# EAGLE schematic ArduinoOnBoard (EAGLE 8.4.1)
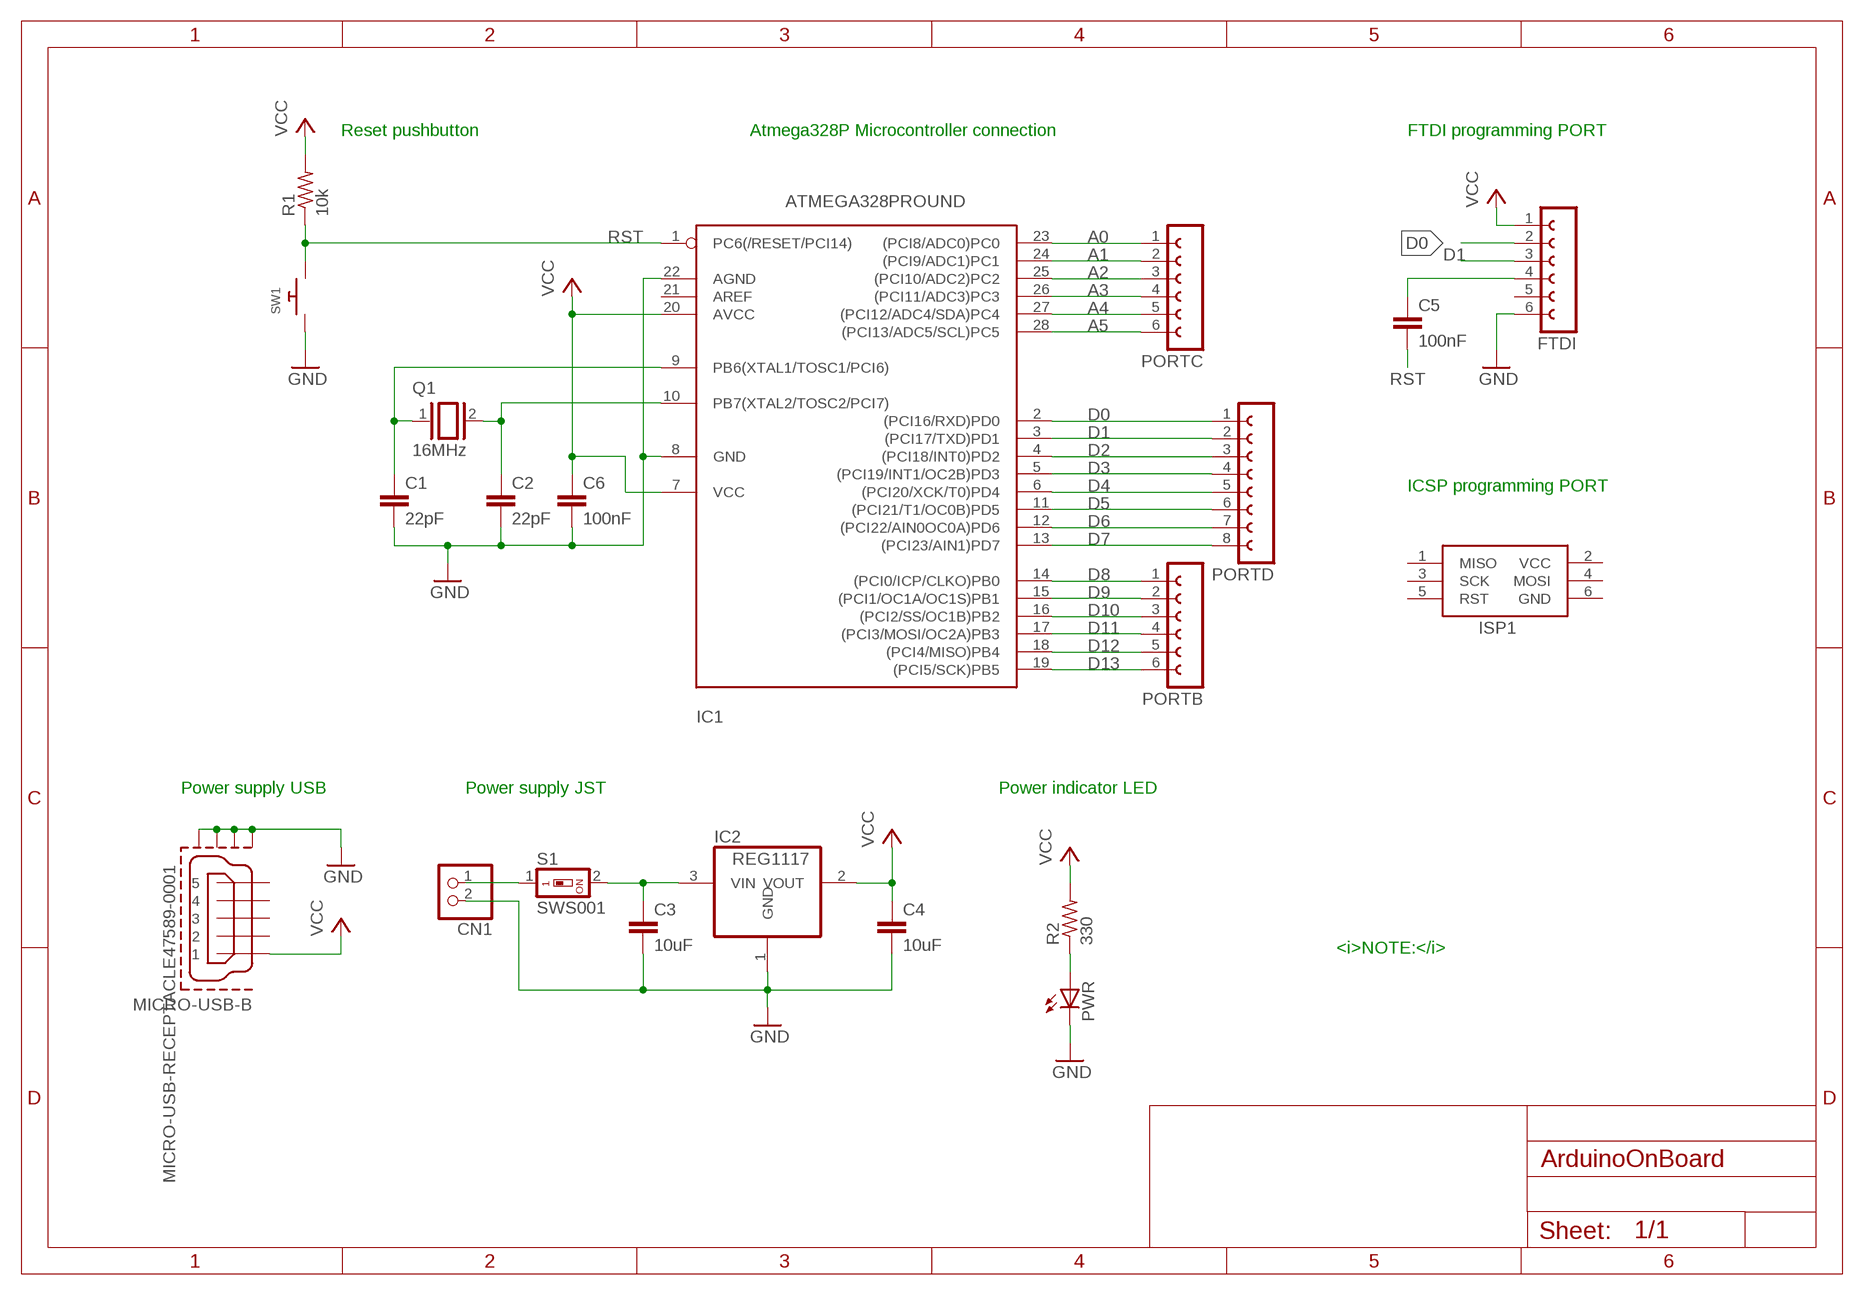
[diagram p0: schematic, sheet 1]

## Parts
C1  22pF  C-EUC1310  [C1310]
C2  22pF  C-EUC1310  [C1310]
C3  10uF  C-EUC1310  [C1310]
C4  10uF  C-EUC1310  [C1310]
C5  100nF  C-EUC1310  [C1310]
C6  100nF  C-EUC1310  [C1310]
CN1  JST_2PIN-SMT  [JST-PH-2-SMT]
FTDI  FE06-1  [FE06]
IC1  ATMEGA328PROUND  [DIL28-3-ROUND]
IC2  REG1117  [SOT223]
ISP1  AVRISP-6  [AVRISP]
MICRO-USB-B  MICRO-USB-RECEPTACLE47589-0001  [47589-0001]
PORTB  FE06-1  [FE06]
PORTC  FE06-1  [FE06]
PORTD  FE08-1  [FE08]
PWR  LEDCHIPLED_0805  [CHIPLED_0805]
Q1  16MHz  XTAL/S  [QS]
R1  10k  R-US_M1206  [M1206]
R2  330  R-US_M1206  [M1206]
S1  SWS001  [SMS-001]
SW1  SWITCH_PUSHBUTTONEVQ-PE  [TACT_PANA-EVQ]

## Nets
A0: IC1.23((PCI8/ADC0)PC0) PORTC.1
A1: IC1.24((PCI9/ADC1)PC1) PORTC.2
A2: IC1.25((PCI10/ADC2)PC2) PORTC.3
A3: IC1.26((PCI11/ADC3)PC3) PORTC.4
A4: IC1.27((PCI12/ADC4/SDA)PC4) PORTC.5
A5: IC1.28((PCI13/ADC5/SCL)PC5) PORTC.6
D0: FTDI.2 IC1.2((PCI16/RXD)PD0) PORTD.1
D1: FTDI.3 IC1.3((PCI17/TXD)PD1) PORTD.2
D2: IC1.4((PCI18/INT0)PD2) PORTD.3
D3: IC1.5((PCI19/INT1/OC2B)PD3) PORTD.4
D4: IC1.6((PCI20/XCK/T0)PD4) PORTD.5
D5: IC1.11((PCI21/T1/OC0B)PD5) PORTD.6
D6: IC1.12((PCI22/AIN0OC0A)PD6) PORTD.7
D7: IC1.13((PCI23/AIN1)PD7) PORTD.8
D8: IC1.14((PCI0/ICP/CLKO)PB0) PORTB.1
D9: IC1.15((PCI1/OC1A/OC1S)PB1) PORTB.2
D10: IC1.16((PCI2/SS/OC1B)PB2) PORTB.3
D11: IC1.17((PCI3/MOSI/OC2A)PB3) PORTB.4
D12: IC1.18((PCI4/MISO)PB4) PORTB.5
D13: IC1.19((PCI5/SCK)PB5) PORTB.6
GND: C1.2 C2.2 C3.2 C4.2 C6.2 CN1.2 FTDI.6 IC1.8(GND) IC1.22(AGND) IC2.1(GND) MICRO-USB-B.CASING1(GND1) MICRO-USB-B.CASING2(GND2) MICRO-USB-B.CASING3(GND3) MICRO-USB-B.CASING4(GND4) PWR.C SW1.P$1
N$1: C5.1 FTDI.4
N$2: C1.1 IC1.9(PB6(XTAL1/TOSC1/PCI6)) Q1.1
N$3: C2.1 IC1.10(PB7(XTAL2/TOSC2/PCI7)) Q1.2
N$4: C3.1 IC2.3(VIN) S1.2
N$5: PWR.A R2.1
N$6: CN1.1 S1.1
RST: C5.2 IC1.1(PC6(/RESET/PCI14)) R1.1 SW1.P$2
VCC: C4.1 C6.1 FTDI.1 IC1.7(VCC) IC1.20(AVCC) IC2.2(VOUT) MICRO-USB-B.1 R1.2 R2.2
Unconnected: FTDI.5 IC1.21(AREF) ISP1.1(MISO) ISP1.3(SCK) ISP1.4(MOSI) ISP1.5(RST) MICRO-USB-B.2 MICRO-USB-B.3 MICRO-USB-B.4 MICRO-USB-B.5

## Notes on the sheet
- Reset pushbutton | Atmega328P Microcontroller connection | FTDI programming PORT
- ICSP programming PORT
- Power supply USB | Power supply JST | Power indicator LED
- <i>NOTE:</i>

## Power pins joined to a net without a drawn wire
GND: ISP1.6(GND)
VCC: ISP1.2(VCC)

## Library data of the parts
C1-C6 = rcl:C-EU: CAPACITOR, European symbol; SPICEPREFIX: C
CN1 = adafruit:JST_2PIN: JST 2-Pin Connectors of various flavors SMT-RA (S2B-PH-SM4) 4UConnector #17311 SMT (B2B-PH-SM4) THM-RA (S2B-PH) THM (B2B-PH)
FTDI PORTB PORTC = con-lsta:FE06-1: FEMALE HEADER; OC_FARNELL: unknown; OC_NEWARK: unknown
IC1 = atmega328:ATMEGA328*P: MICROCONTROLLER 32 kBytes FLASH 2 kBytes SRAM 1 kBytes EEPROM USART 8-channel 10 bit ADC
IC2 = burr-brown:REG1117: 800mA and 1A Low Dropout (LDO) Positive Regulator 1.8V, 2.5V, 2.85V, 3.3V, 5V, and Adj; MPN: REG1117; OC_FARNELL: 1097566; OC_NEWARK: 14P6981
ISP1 = adafruit:AVRISP: AVR ISP HEADER Standard 6 pin header for AVR programming
MICRO-USB-B = con-molex-usb:MICRO-USB-RECEPTACLE: MICRO USB RECEPTACLES Micro-USB Receptacles, SMT, Lead-Free from MOLEX <http://www.molex.com/>. (C) 2014 Tomasz Boleslaw CEDRO, cederom@tlen.pl, http://www.tomek.cedro.info. Version 0.1 (2014-01-17): Initial release. Version 0.2 (2014-02-06): Updated 47589-0001 footprint pins/pads/milling. Following devices are included: 1. 47589-0001 Micro-USB AB Receptacle, Bottom Mount, SMT, Lead-Free <http://www.molex.com/molex/products/datasheet.jsp?part=active/0475890001_IO_CONNECTORS.xml> (Technical Drawing <http://www.molex.com/pdm_docs/sd/475890001_sd.pdf>).
PORTD = con-lsta:FE08-1: FEMALE HEADER; OC_FARNELL: unknown; OC_NEWARK: unknown
PWR = adafruit:LED: LED OSRAM: - CHIPLED LG R971, LG N971, LY N971, LG Q971, LY Q971, LO R971, LY R971 LH N974, LH R974 LS Q976, LO Q976, LY Q976 LO Q996 - Hyper CHIPLED LW Q18S LB Q993, LB Q99A, LB R99A - SideLED LS A670, LO A670, LY A670, LG A670, LP A670 LB A673, LV A673, LT A673, LW A673 LH A674 LY A675 LS A676, LA A676, LO A676, LY A676, LW A676 LS A679, LY A679, LG A679 - Hyper Micro SIDELED® LS Y876, LA Y876, LO Y876, LY Y876 LT Y87S - SmartLED LW L88C, LW L88S LB L89C, LB L89S, LG L890 LS L89K, LO L89K, LY L89K LS L896, LA L896, LO L896, LY L896 - TOPLED LS T670, LO T670, LY T670, LG T670, LP T670 LSG T670, LSP T670, LSY T670, LOP T670, LYG T670 LG T671, LOG T671, LSG T671 LB T673, LV T673, LT T673, LW T673 LH T674 LS T676, LA T676, LO T676, LY T676, LB T676, LH T676, LSB T676, LW T676 LB T67C, LV T67C, LT T67C, LS T67K, LO T67K, LY T67K, LW E67C LS E67B, LA E67B, LO E67B, LY E67B, LB E67C, LV E67C, LT E67C LW T67C LS T679, LY T679, LG T679 LS T770, LO T770, LY T770, LG T770, LP T770 LB T773, LV T773, LT T773, LW T773 LH T774 LS E675, LA E675, LY E675, LS T675 LS T776, LA T776, LO T776, LY T776, LB T776 LHGB T686 LT T68C, LB T68C - Hyper Mini TOPLED® LB M676 - Mini TOPLED Santana® LG M470 LS M47K, LO M47K, LY M47K Source: http://www.osram.convergy.de/
Q1 = special:XTAL/S: CRYSTAL
R1 R2 = adafruit:R-US_: RESISTOR, American symbol
S1 = smd-special:SWS001: SMD Dip Switch 1 pol.
SW1 = adafruit:SWITCH_PUSHBUTTON: Buttons SOFTTOUCHSMD_SJ - Soft touch temporary push button (Super Junk Akihabara) Compatible with SKPMANE010 [Mouser: 688-SKPMAN] C&K_KSS = Digikey: KSS221GLFS